# Altium schematic sheet DM2080_LEFT_OV9782.SchDoc: =project_title
size Tabloid; PageSetup: Record=PageOptions|CenterHorizontal=True|CenterVertical=True|PrintScale=0.71|XCorrection=1.00|YCorrection=1.00|PrintKind=0|BorderSize=5000000|LeftOffset=0|BottomOffset=0|Orientation=2|PaperLength=1000|PaperWidth=1000|Scale=100|PaperSource=7|PrintQuality=-4|MediaType=1|DitherType=10|PrintScaleMode=1|PaperKind=A4; CompanyName: Luxonis Holding; Organization: Luxonis Holding; Address1: 1925 Harmony Park Drive; Address2: Westminster, CO; Address3: 80234; Address4: United States; SheetNumber: 6; SheetTotal: 9
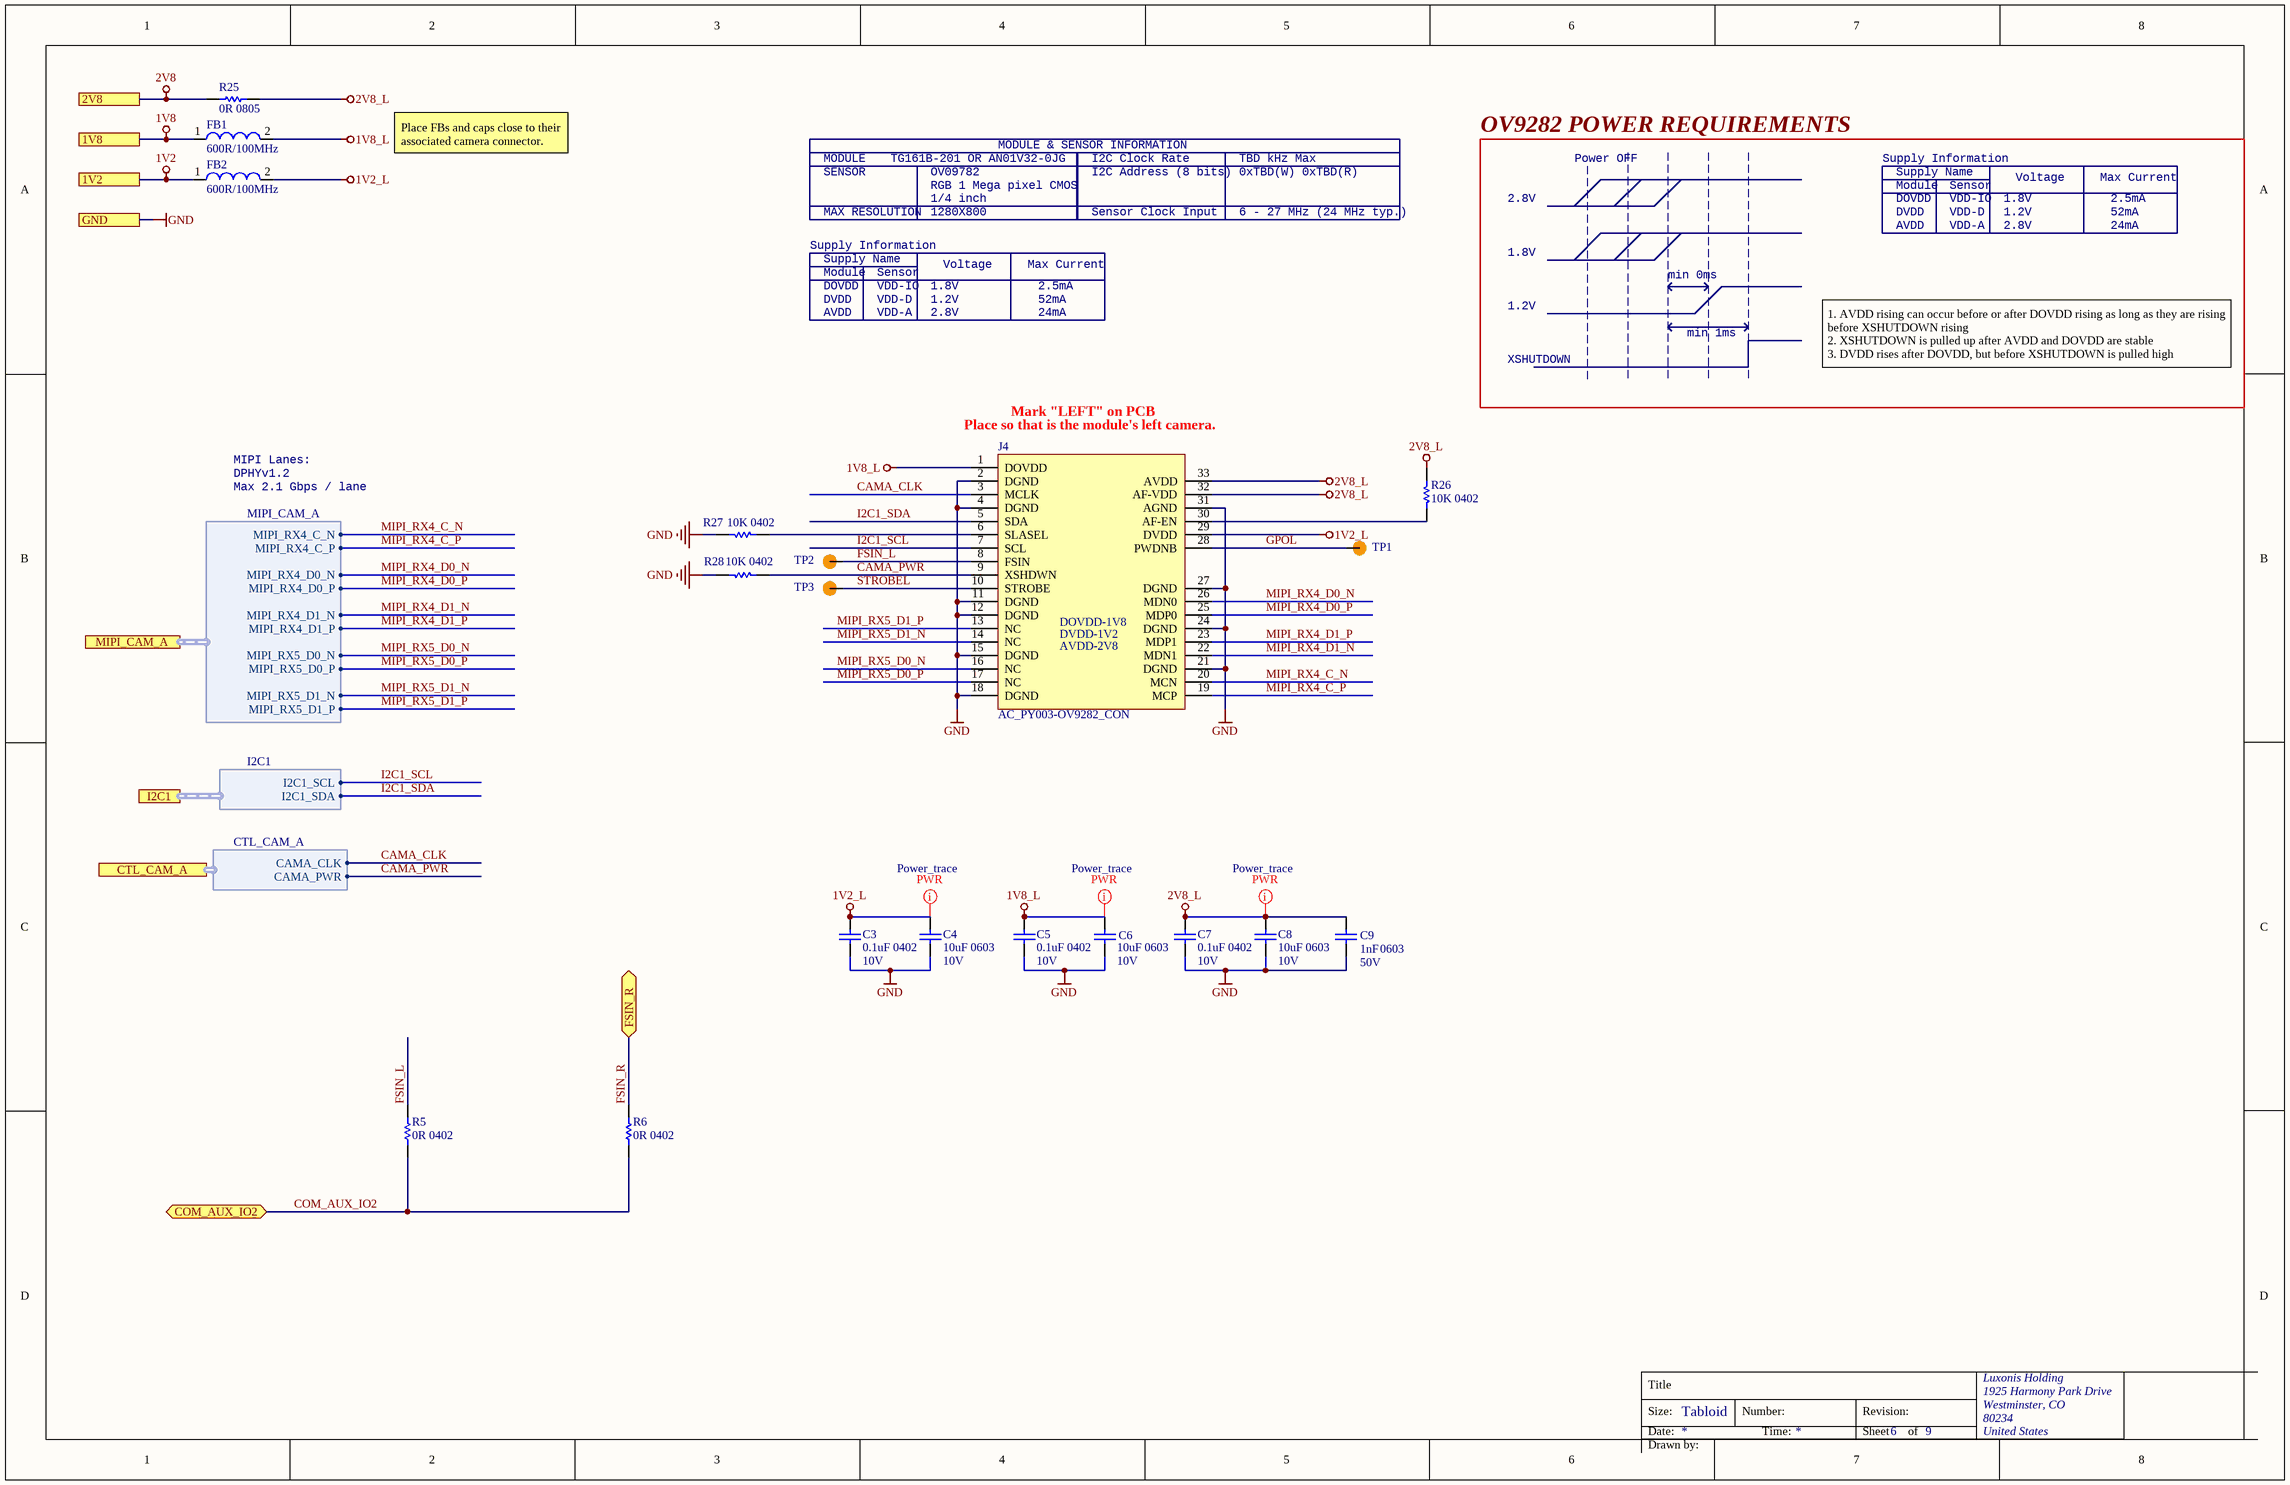
[diagram p0: DM2080_LEFT_OV9782.SchDoc]

## Parts
C3  0.1uF 0402  Voltage Rating: 10V  [CAPC0402(1005)70_L]
C4  10uF 0603  Voltage Rating: 10V  [CAPC0603(1608)100_L]
C5  0.1uF 0402  Voltage Rating: 10V  [CAPC0402(1005)70_L]
C6  10uF 0603  Voltage Rating: 10V  [CAPC0603(1608)100_L]
C7  0.1uF 0402  Voltage Rating: 10V  [CAPC0402(1005)70_L]
C8  10uF 0603  Voltage Rating: 10V  [CAPC0603(1608)100_L]
C9  Case/Package: 0603  Capacitance: 1nF  Voltage Rating: 50V  [CAPC0603(1608)100_L]  (hidden comment: 1nF 0603 C0G)
FB1  600R/100MHz  [2508056017Y2]
FB2  600R/100MHz  [2508056017Y2]
J4  AC_PY003-OV9282_CON  [AC-PY003-OV9282]
R5  0R 0402  [RESC0402(1005)_L]
R6  0R 0402  [RESC0402(1005)_L]
R25  0R 0805  [RESC0805(2012)_L]
R26  10K 0402  [RESC0402(1005)_L]
R27  10K 0402  [RESC0402(1005)_L]
R28  10K 0402  [RESC0402(1005)_L]
TP1  TP100_200_NS  [TP100_200_NS]  (value not drawn)  (no BOM)
TP2  TP100_200_NS  [TP100_200_NS]  (value not drawn)  (no BOM)
TP3  TP100_200_NS  [TP100_200_NS]  (value not drawn)  (no BOM)

## Ports
1V2, 1V8, 2V8, COM_AUX_IO2 (bidir), CTL_CAM_A (harness CTL_CAM_A), FSIN_R (bidir), GND, I2C1 (harness I2C1), MIPI_CAM_A (harness MIPI_CAM_A)

## Harnesses
MIPI_CAM_A: MIPI_RX4_C_P, MIPI_RX4_C_N, MIPI_RX4_D0_P, MIPI_RX4_D0_N, MIPI_RX4_D1_P, MIPI_RX4_D1_N, MIPI_RX5_D0_P, MIPI_RX5_D0_N, MIPI_RX5_D1_P, MIPI_RX5_D1_N
I2C1: I2C1_SDA, I2C1_SCL
CTL_CAM_A: CAMA_PWR, CAMA_CLK

## Nets
1V2: FB2.1 ; port 1V2
1V2_L: C3.2 C4.2 FB2.2 J4.29(DVDD)
1V8: FB1.1 ; port 1V8
1V8_L: C5.2 C6.2 FB1.2 J4.1(DOVDD)
2V8: R25.1 ; port 2V8
2V8_L: C7.2 C8.2 C9.2 J4.32(AF-VDD) J4.33(AVDD) R25.2 R26.1
GND: C3.1 C4.1 C5.1 C6.1 C7.1 C8.1 C9.1 J4.2(DGND) J4.4(DGND) J4.11(DGND) J4.12(DGND) J4.15(DGND) J4.18(DGND) J4.21(DGND) J4.24(DGND) J4.27(DGND) J4.31(AGND) R27.2 R28.2 ; port GND
CAMA_CLK: J4.3(MCLK) ; port CTL_CAM_A.CAMA_CLK
CAMA_PWR: J4.9(XSHDWN) R28.1 ; port CTL_CAM_A.CAMA_PWR
COM_AUX_IO2: R5.2 R6.2 ; port COM_AUX_IO2
FSIN_L: J4.8(FSIN) R5.1 TP2.1
FSIN_R: R6.1 ; port FSIN_R
GPOL: J4.28(PWDNB) TP1.1
I2C1_SCL: J4.7(SCL) ; port I2C1.I2C1_SCL
I2C1_SDA: J4.5(SDA) ; port I2C1.I2C1_SDA
MIPI_RX4_C_N: J4.20(MCN) ; port MIPI_CAM_A.MIPI_RX4_C_N
MIPI_RX4_C_P: J4.19(MCP) ; port MIPI_CAM_A.MIPI_RX4_C_P
MIPI_RX4_D0_N: J4.26(MDN0) ; port MIPI_CAM_A.MIPI_RX4_D0_N
MIPI_RX4_D0_P: J4.25(MDP0) ; port MIPI_CAM_A.MIPI_RX4_D0_P
MIPI_RX4_D1_N: J4.22(MDN1) ; port MIPI_CAM_A.MIPI_RX4_D1_N
MIPI_RX4_D1_P: J4.23(MDP1) ; port MIPI_CAM_A.MIPI_RX4_D1_P
MIPI_RX5_D0_N: J4.16(NC) ; port MIPI_CAM_A.MIPI_RX5_D0_N
MIPI_RX5_D0_P: J4.17(NC) ; port MIPI_CAM_A.MIPI_RX5_D0_P
MIPI_RX5_D1_N: J4.14(NC) ; port MIPI_CAM_A.MIPI_RX5_D1_N
MIPI_RX5_D1_P: J4.13(NC) ; port MIPI_CAM_A.MIPI_RX5_D1_P
STROBEL: J4.10(STROBE) TP3.1
NetJ4_6: J4.6(SLASEL) R27.1
NetJ4_30: J4.30(AF-EN) R26.2

## Layout directives
net class Power_trace: 1V2_L, 1V8_L, 2V8_L

## Notes on the sheet
- Place FBs and caps close to their associated camera connector.
- MODULE
- TG161B-201 OR AN01V32-0JG
- MODULE & SENSOR INFORMATION
- I2C Clock Rate
- TBD kHz Max
- OV9282 POWER REQUIREMENTS
- Power OFF
- Supply Information
- SENSOR
- MAX RESOLUTION
- RGB 1 Mega pixel CMOS
- 1280X800
- OV09782
- 1/4 inch
- I2C Address (8 bits)
- Sensor Clock Input
- 6 - 27 MHz (24 MHz typ.)
- 0xTBD(W) 0xTBD(R)
- 2.8V
- AVDD
- DOVDD
- DVDD
- Supply Name
- Module
- VDD-A
- VDD-IO
- VDD-D
- Sensor
- 1.8V
- 1.2V
- Voltage
- Max Current
- 24mA
- 2.5mA
- 52mA
- min 0ms
- XSHUTDOWN
- min 1ms
- 1. AVDD rising can occur before or after DOVDD rising as long as they are rising before XSHUTDOWN rising
  2. XSHUTDOWN is pulled up after AVDD and DOVDD are stable
  3. DVDD rises after DOVDD, but before XSHUTDOWN is pulled high
- (near J4) Place so that is the module's left camera.
- (near J4) Mark "LEFT" on PCB
- MIPI Lanes:
- Max 2.1 Gbps / lane
- DPHYv1.2
- Title
- Size:
- Date:
- Tabloid
- Number:
- Time:
- Revision:
- Sheet
- of
- Drawn by:
- (in symbol CMP-005-000036-1) DOVDD-1V8; DVDD-1V2; AVDD-2V8

## Library data of the parts
C3 C5 C7 = GRM155R71A104JA01D: CAP CER 0.1UF 10V X7R 0402 5%; Manufacturer 1: Murata; Capacitance: 100nF; Supplier 1: Digi-Key; Manufacturer Part Number 1: GRM155R71A104JA01D; Stock 1: 1346709; Pricing 1: 1=0.10000, 10=0.02500, 100=0.01130, 500=0.00806, 1000=0.00633, 2500=0.00575, 5000=0.00529 (USD); RoHS: Yes; Mount: Surface Mount; Case/Package: 0402; Case Code (Imperial): 0402; Case Code (Metric): 1005; Min Operating Temperature: -55°C; Max Operating Temperature: 125°C; Tolerance: 5%; Packaging: Tape and Reel; Voltage Rating (DC): 10V; Dielectric: X7R; Package Quantity: 10000; Termination: SMD/SMT; Length: 1mm; Height: 0.5mm; Width: 0.02inch; Thickness: 0.022inch; Depth: 0.5mm; Radiation Hardening: No; Lead Free: Lead Free; ComponentLink1URL: https://datasheet.ciiva.com/5411/product-5411135.pdf?src-supplier=Mouser; ComponentLink1Description: https://datasheet.ciiva.com/5411/product-5411135.pdf?src-supplier=Mouser; ComponentLink2URL: https://datasheet.ciiva.com/11618/c02e-11618821.pdf?src-supplier=Avnet; ComponentLink2Description: https://datasheet.ciiva.com/11618/c02e-11618821.pdf?src-supplier=Avnet; Supplier Part Number 1: 490-10777-1-ND
C4 C6 C8 = GRM188R61A106ME69D: CAP CER 10UF 10V X5R 0603 20%; Manufacturer 1: Murata; Material: Ceramic; Supplier 1: Digi-Key; Manufacturer Part Number 1: GRM188R61A106ME69D; Stock 1: 2873098; Pricing 1: 1=0.21000, 10=0.14100, 100=0.07130, 500=0.04876, 1000=0.04313 (USD); RoHS: Yes; Mount: Surface Mount; Case/Package: 0603; Weight: 0.000222oz; Case Code (Metric): 1608; Case Code (Imperial): 0603; Min Operating Temperature: -55°C; Max Operating Temperature: 85°C; Packaging: Tape and Reel; Tolerance: 20%; Capacitance: 10uF; Dielectric: X5R; Voltage Rating (DC): 10V; Package Quantity: 4000; Termination: SMD/SMT; Length: 1.6mm; Height: 0.8mm; Width: 0.8mm; Thickness: 0.035inch; Depth: 0.8mm; REACH SVHC: Unknown; Lead Free: Lead Free; ComponentLink1URL: http://www.mouser.com/ds/2/281/c02e-2905.pdf?src-supplier=Mouser; ComponentLink1Description: http://www.mouser.com/ds/2/281/c02e-2905.pdf?src-supplier=Mouser; ComponentLink2URL: http://components.arrow.com/part/dataview/0323_06119472?src-supplier=Arrow+Europe; ComponentLink2Description: http://components.arrow.com/part/dataview/0323_06119472?src-supplier=Arrow+Europe; ComponentLink3URL: http://www.farnell.com/datasheets/2048014.pdf?src-supplier=Farnell; ComponentLink3Description: http://www.farnell.com/datasheets/2048014.pdf?src-supplier=Farnell; ComponentLink4URL: http://www.farnell.com/datasheets/1872210.pdf?src-supplier=Farnell; ComponentLink4Description: http://www.farnell.com/datasheets/1872210.pdf?src-supplier=Farnell; ComponentLink5URL: http://search.murata.co.jp/Ceramy/image/img/A01X/G101/ENG/GRM188R61A106ME69-01.pdf?src-supplier=Digi-Key; ComponentLink5Description: http://search.murata.co.jp/Ceramy/image/img/A01X/G101/ENG/GRM188R61A106ME69-01.pdf?src-supplier=Digi-Key; ComponentLink6URL: http://www.farnell.com/datasheets/1872210.pdf?src-supplier=Newark; ComponentLink6Description: http://www.farnell.com/datasheets/1872210.pdf?src-supplier=Newark; ComponentLink7URL: http://www.farnell.com/datasheets/2048014.pdf?src-supplier=Element14; ComponentLink7Description: http://www.farnell.com/datasheets/2048014.pdf?src-supplier=Element14; ComponentLink8URL: http://www.farnell.com/datasheets/2048014.pdf?src-supplier=Newark; ComponentLink8Description: http://www.farnell.com/datasheets/2048014.pdf?src-supplier=Newark; Supplier Part Number 1: 490-10475-1-ND
C9 = GRM1885C1H102FA01D: CAP CER 1000PF 50V C0G/NP0 0603; Manufacturer: Murata; Material: Ceramic; Tolerance: 1%; Temperature Coefficient: 30ppm/°C; Manufacturer Part Number: GRM1885C1H102FA01D; RoHS: Yes; Mount: Surface Mount; Number of Pins: 2; Case Code (Metric): 1608; Case Code (Imperial): 0603; Min Operating Temperature: -55°C; Max Operating Temperature: 125°C; Packaging: Tape and Reel; Package Quantity: 4000; Termination: SMD/SMT; Voltage Rating (DC): 50V; Voltage: 50V; Length: 1.6mm; Height: 0.8mm; Width: 0.031inch; Thickness: 0.035inch; Depth: 0.8mm; Radiation Hardening: No; REACH SVHC: No SVHC; Lead Free: Lead Free; ComponentLink1URL: https://datasheet.ciiva.com/6072/1747444-6072454.pdf?src-supplier=Farnell; ComponentLink1Description: https://datasheet.ciiva.com/6072/1747444-6072454.pdf?src-supplier=Farnell; ComponentLink2URL: https://datasheet.ciiva.com/7828/1747444-7828892.pdf?src-supplier=Element14; ComponentLink2Description: https://datasheet.ciiva.com/7828/1747444-7828892.pdf?src-supplier=Element14; ComponentLink3URL: https://datasheet.ciiva.com/11621/c02e-11621692.pdf?src-supplier=Avnet; ComponentLink3Description: https://datasheet.ciiva.com/11621/c02e-11621692.pdf?src-supplier=Avnet; ComponentLink4URL: https://datasheet.ciiva.com/16624/c02e-16624140.pdf?src-supplier=Avnet+Europe; ComponentLink4Description: https://datasheet.ciiva.com/16624/c02e-16624140.pdf?src-supplier=Avnet+Europe; ComponentLink5URL: https://datasheet.ciiva.com/22698/1747444-22698428.pdf?src-supplier=Element14; ComponentLink5Description: https://datasheet.ciiva.com/22698/1747444-22698428.pdf?src-supplier=Element14; ComponentLink6URL: https://datasheet.ciiva.com/5416/c02e-5416637.pdf?src-supplier=Mouser; ComponentLink6Description: https://datasheet.ciiva.com/5416/c02e-5416637.pdf?src-supplier=Mouser; ComponentLink7URL: https://datasheet.ciiva.com/6270/partnumbering-e-01-6270573.pdf?src-supplier=Digi-Key; ComponentLink7Description: https://datasheet.ciiva.com/6270/partnumbering-e-01-6270573.pdf?src-supplier=Digi-Key; ComponentLink8URL: https://datasheet.ciiva.com/6270/partnumbering-e-01-6270574.pdf?src-supplier=Digi-Key; ComponentLink8Description: https://datasheet.ciiva.com/6270/partnumbering-e-01-6270574.pdf?src-supplier=Digi-Key; ComponentLink9URL: https://datasheet.ciiva.com/6270/partnumbering-e-01-6270575.pdf?src-supplier=Digi-Key; ComponentLink9Description: https://datasheet.ciiva.com/6270/partnumbering-e-01-6270575.pdf?src-supplier=Digi-Key; ComponentLink10URL: https://datasheet.ciiva.com/16426/l0005e-16426367.pdf?src-supplier=Future+Electronics; ComponentLink10Description: https://datasheet.ciiva.com/16426/l0005e-16426367.pdf?src-supplier=Future+Electronics; Supplier 1: Digi-Key; Manufacturer 1: Murata; Manufacturer Part Number 1: GRM1885C1H102FA01D; Stock 1: 343900; Pricing 1: 1=0.19000, 10=0.13300, 100=0.06260, 500=0.04386, 1000=0.03631 (USD); Dielectric: C0G; Supplier Part Number 1: 490-6376-1-ND
FB1 FB2 = 2508056017Y2: FERRITE BEAD, 0.1OHM, 2A, 0805, 600R/100MHz; Manufacturer 1: Fair-Rite; Impedance: 600R; Tolerance: 25%; Resistance: 350mR; DC Resistance (DCR): 100mR; Test Frequency: 100MHz; Supplier 1: Digi-Key; Manufacturer Part Number 1: 2508056017Y2; Stock 1: 100491; Pricing 1: 1=0.10000, 10=0.07900, 25=0.07120, 50=0.05240, 100=0.04520, 250=0.03568, 500=0.03014, 1000=0.02538 (USD); RoHS: Yes; Case/Package: 0805; Number of Pins: 2; Case Code (Metric): 2012; Case Code (Imperial): 0805; Min Operating Temperature: -55°C; Max Operating Temperature: 125°C; Package Quantity: 4000; Packaging: Tape and Reel; Max DC Current: 2A; Termination: SMD/SMT; Military Standard: Not; DC Current: 2A; Current Rating: 2A; Frequency: 100MHz; Length: 2mm; Height: 0.9mm; Width: 1.25mm; Depth: 1.25mm; Radiation Hardening: No; REACH SVHC: No SVHC; ComponentLink1URL: https://datasheet.ciiva.com/3854/3802508056017y2-3854245.pdf?src-supplier=Arrow; ComponentLink1Description: https://datasheet.ciiva.com/3854/3802508056017y2-3854245.pdf?src-supplier=Arrow; ComponentLink2URL: https://datasheet.ciiva.com/22735/652149-22735047.pdf?src-supplier=Element14; ComponentLink2Description: https://datasheet.ciiva.com/22735/652149-22735047.pdf?src-supplier=Element14; ComponentLink3URL: https://datasheet.ciiva.com/1127/26143-1127514.pdf?src-supplier=Farnell; ComponentLink3Description: https://datasheet.ciiva.com/1127/26143-1127514.pdf?src-supplier=Farnell; ComponentLink4URL: https://datasheet.ciiva.com/18090/getdatasheetpartid-212640-18090187.pdf?src-supplier=Verical; ComponentLink4Description: https://datasheet.ciiva.com/18090/getdatasheetpartid-212640-18090187.pdf?src-supplier=Verical; ComponentLink5URL: https://datasheet.ciiva.com/7620/26143-7620140.pdf?src-supplier=Element14; ComponentLink5Description: https://datasheet.ciiva.com/7620/26143-7620140.pdf?src-supplier=Element14; Supplier Part Number 1: 1934-1487-1-ND
J4 = CMP-005-000036-1: FFC/FPC Connector, 33 Contact(s), 1 Row(s), Female, Right Angle, Surface Mount Terminal; Manufacturer 1: Hirose; Manufacturer Part Number 1: FH26W-33S-0.3SHW(60); ComponentLink1Description: https://datasheet.ciiva.com:443/pdfs/VipMasterIC/IC/HIRO/HIRO-S-A0007913874/HIRO-S-A0008593114-1.pdf?src-supplier=IHS+Markit; ComponentLink3Description: https://www.hirose.com/product/download/?distributor=digikey&amp;type=2d&amp;lang=en&amp;num=FH26W-13S-0.3SHW(60)&src-supplier=Digi-Key; ComponentLink1URL: https://datasheet.ciiva.com:443/pdfs/VipMasterIC/IC/HIRO/HIRO-S-A0007913874/HIRO-S-A0008593114-1.pdf?src-supplier=IHS+Markit; Source: LuxonisMaster.SchLib; ComponentLink2Description: https://www.hirose.com/product/en/download_file/key_name/FH26/category/Catalog/doc_file_id/49355/?file_category_id=4&item_id=298&is_series=1&src-supplier=Digi-Key; Pricing 1: 1=1,78000, 10=1,61700, 25=1,51800, 50=1,45200, 100=1,38600, 250=1,25400, 500=1,15500, 1000=0,99000, 2500=0,92400 (USD); Category: FFC / FPC; Design Item ID: AC_PY003-OV9282_CON; ComponentLink2URL: https://www.hirose.com/product/en/download_file/key_name/FH26/category/Catalog/doc_file_id/49355/?file_category_id=4&item_id=298&is_series=1&src-supplier=Digi-Key; RoHS: Yes; Stock 1: 627; ComponentLink3URL: https://www.hirose.com/product/download/?distributor=digikey&amp;type=2d&amp;lang=en&amp;num=FH26W-13S-0.3SHW(60)&src-supplier=Digi-Key
R5 R6 = CRCW04020000Z0ED: RES SMD 0 OHM JUMPER 1/16W 0402; Manufacturer 1: Vishay; Resistance: 0mR; Power Rating: 63mW; Voltage Rating: 50V; Temperature Coefficient: 100ppm/°C; Tolerance: 5%; Manufacturer Part Number 1: CRCW04020000Z0ED; Supplier 1: Digi-Key; Stock 1: 855968; Pricing 1: 1=0.10000, 10=0.03400, 25=0.02440, 50=0.01860, 100=0.01380, 250=0.01048, 500=0.00840, 1000=0.00618, 5000=0.00443 (USD); RoHS: Yes; Mount: Surface Mount; Case/Package: 0402; Weight: 2.3E-05oz; Case Code (Imperial): 0402; Case Code (Metric): 1005; Contact Plating: Tin; Min Operating Temperature: -55°C; Max Operating Temperature: 155°C; Packaging: Tape and Reel; Composition: Thick Film; Voltage Rating (DC): 50V; Package Quantity: 1; Termination: SMD/SMT; Number of Terminations: 2; Military Standard: Not; Max Power Dissipation: 63mW; Features: Automotive AEC-Q200; Length: 1mm; Height: 0.35mm; Width: 0.5mm; Depth: 0.5mm; Radiation Hardening: No; REACH SVHC: Unknown; Lead Free: Lead Free; ComponentLink1URL: https://datasheet.ciiva.com/3255/dcrcwe3-3255944.pdf?src-supplier=Avnet; ComponentLink1Description: https://datasheet.ciiva.com/3255/dcrcwe3-3255944.pdf?src-supplier=Avnet; ComponentLink2URL: https://datasheet.ciiva.com/3255/dcrcwe3-3255945.pdf?src-supplier=Avnet; ComponentLink2Description: https://datasheet.ciiva.com/3255/dcrcwe3-3255945.pdf?src-supplier=Avnet; ComponentLink3URL: https://datasheet.ciiva.com/16881/dcrcwe3-16881413.pdf?src-supplier=Avnet+Europe; ComponentLink3Description: https://datasheet.ciiva.com/16881/dcrcwe3-16881413.pdf?src-supplier=Avnet+Europe; ComponentLink4URL: https://datasheet.ciiva.com/2461/dcrcwe3-2461962.pdf?src-supplier=Digi-Key; ComponentLink4Description: https://datasheet.ciiva.com/2461/dcrcwe3-2461962.pdf?src-supplier=Digi-Key; ComponentLink5URL: https://datasheet.ciiva.com/7841/1720486-7841802.pdf?src-supplier=Element14; ComponentLink5Description: https://datasheet.ciiva.com/7841/1720486-7841802.pdf?src-supplier=Element14; ComponentLink6URL: https://datasheet.ciiva.com/2461/dcrcwe3-2461963.pdf?src-supplier=Digi-Key; ComponentLink6Description: https://datasheet.ciiva.com/2461/dcrcwe3-2461963.pdf?src-supplier=Digi-Key; ComponentLink7URL: https://datasheet.ciiva.com/2461/dcrcwe3-2461964.pdf?src-supplier=Digi-Key; ComponentLink7Description: https://datasheet.ciiva.com/2461/dcrcwe3-2461964.pdf?src-supplier=Digi-Key; ComponentLink8URL: https://datasheet.ciiva.com/7841/1697337-7841468.pdf?src-supplier=Element14; ComponentLink8Description: https://datasheet.ciiva.com/7841/1697337-7841468.pdf?src-supplier=Element14; ComponentLink9URL: https://datasheet.ciiva.com/16761/70200976-16761309.pdf?src-supplier=Allied+Electronics; ComponentLink9Description: https://datasheet.ciiva.com/16761/70200976-16761309.pdf?src-supplier=Allied+Electronics; ComponentLink10URL: https://datasheet.ciiva.com/26311/fld-crcw-e3-data-en-26311550.pdf?src-supplier=Distrelec; ComponentLink10Description: https://datasheet.ciiva.com/26311/fld-crcw-e3-data-en-26311550.pdf?src-supplier=Distrelec; Supplier Part Number 1: 541-0.0JCT-ND
R25 = CRCW08050000Z0EA: RES SMD 0.0R OHM 1% 1/8W 0805; Manufacturer 1: Vishay; Rated Temperature: 70°C; Rated Power Dissipation (P): 125mW; Package Height: 0.45mm; Package Length: 2mm; Package Width: 1.25mm; Reference Standard: AEC-Q200; Supplier 1: RSComponents; Manufacturer Part Number 1: CRCW08050000Z0EA; RoHS: Yes; Category: Chip SMD Resistors; Stock 1: 850; Pricing 1: 50=0,02700, 250=0,02400, 500=0,02000, 750=0,01500, 1000=0,01300, 50=0,01900, 250=0,01700, 500=0,01400, 750=0,01100, 1000=0,00900 (USD); Mount: Surface Mount; Number of Pins: 2; Terminal Finish: Nickel; Package Shape: Rectangular; Min Operating Temperature: -55°C; Max Operating Temperature: 155°C; Resistor Type: FIXED RESISTOR; Packaging: Tape and Reel; JESD-609 Code: e3; Termination: Wraparound; Construction: Chip; Package Style: SMTMeter; Technology: METAL GLAZE/THICK FILM; REACH SVHC: Yes; RoHS Compliant: Yes; ComponentLink1URL: https://datasheet.ciiva.com:443/pdfs/VipMasterIC/IC/VISH/VISH-S-A0007266705/VISH-S-A0007266705-1.pdf?src-supplier=IHS+Markit; ComponentLink1Description: https://datasheet.ciiva.com:443/pdfs/VipMasterIC/IC/VISH/VISH-S-A0007266705/VISH-S-A0007266705-1.pdf?src-supplier=IHS+Markit; ComponentLink2URL: https://datasheet.ciiva.com/11811/0900766b80d98b26-11811304.pdf?src-supplier=RSComponents; ComponentLink2Description: https://datasheet.ciiva.com/11811/0900766b80d98b26-11811304.pdf?src-supplier=RSComponents; ComponentLink3URL: https://datasheet.ciiva.com/16883/dcrcwe3-16883622.pdf?src-supplier=Avnet+Europe; ComponentLink3Description: https://datasheet.ciiva.com/16883/dcrcwe3-16883622.pdf?src-supplier=Avnet+Europe; ComponentLink4URL: https://datasheet.ciiva.com/26314/fld-crcw-e3-data-en-26314630.pdf?src-supplier=Distrelec; ComponentLink4Description: https://datasheet.ciiva.com/26314/fld-crcw-e3-data-en-26314630.pdf?src-supplier=Distrelec; ComponentLink5URL: https://datasheet.ciiva.com/5543/dcrcwe3-109170-5543096.pdf?src-supplier=Mouser; ComponentLink5Description: https://datasheet.ciiva.com/5543/dcrcwe3-109170-5543096.pdf?src-supplier=Mouser; ComponentLink6URL: https://datasheet.ciiva.com/16389/dcrcwe3-16389338.pdf?src-supplier=Future+Electronics; ComponentLink6Description: https://datasheet.ciiva.com/16389/dcrcwe3-16389338.pdf?src-supplier=Future+Electronics; ComponentLink7URL: https://datasheet.ciiva.com/16719/70201119-16719706.pdf?src-supplier=Allied+Electronics; ComponentLink7Description: https://datasheet.ciiva.com/16719/70201119-16719706.pdf?src-supplier=Allied+Electronics; ComponentLink8URL: https://datasheet.ciiva.com/2463/dcrcwe3-2463037.pdf?src-supplier=Digi-Key; ComponentLink8Description: https://datasheet.ciiva.com/2463/dcrcwe3-2463037.pdf?src-supplier=Digi-Key; ComponentLink9URL: https://datasheet.ciiva.com/7841/1697337-7841629.pdf?src-supplier=Element14; ComponentLink9Description: https://datasheet.ciiva.com/7841/1697337-7841629.pdf?src-supplier=Element14; ComponentLink10URL: https://datasheet.ciiva.com/2463/dcrcwe3-2463038.pdf?src-supplier=Digi-Key; ComponentLink10Description: https://datasheet.ciiva.com/2463/dcrcwe3-2463038.pdf?src-supplier=Digi-Key; ComponentLink11URL: https://datasheet.ciiva.com/2463/dcrcwe3-2463039.pdf?src-supplier=Digi-Key; ComponentLink11Description: https://datasheet.ciiva.com/2463/dcrcwe3-2463039.pdf?src-supplier=Digi-Key; ComponentLink12URL: https://datasheet.ciiva.com/7841/1720486-7841839.pdf?src-supplier=Element14; ComponentLink12Description: https://datasheet.ciiva.com/7841/1720486-7841839.pdf?src-supplier=Element14; Supplier Part Number 1: 6790800; Resistance: 0R; Size Code: 0805
R26-R28 = RC0402FR-1310KL: RES SMD 10K OHM 1% 0402 1/16W Chip Resistor, 0402 [1005 Metric], 10 kohm, RC Series, 50 V, Thick Film, 62.5 mW; Manufacturer 1: Yageo; Resistance: 10kR; Temperature Coefficient: 100ppm/°C; Power Rating: 62.5mW; Voltage Rating: 50V; ComponentLink1URL: https://datasheet.ciiva.com/16940/pyu-rc0402-51-rohs-l-6-16940293.pdf?src-supplier=Avnet+Europe; ComponentLink1Description: https://datasheet.ciiva.com/16940/pyu-rc0402-51-rohs-l-6-16940293.pdf?src-supplier=Avnet+Europe; ComponentLink2URL: https://datasheet.ciiva.com/28386/pyu-rc0402-51-rohs-l-6-28386855.pdf?src-supplier=Avnet+Europe; ComponentLink2Description: https://datasheet.ciiva.com/28386/pyu-rc0402-51-rohs-l-6-28386855.pdf?src-supplier=Avnet+Europe; ComponentLink3URL: https://datasheet.ciiva.com/16740/pyu-rc0402-51-rohs-l-6-r-16740602.pdf?src-supplier=Future+Electronics; ComponentLink3Description: https://datasheet.ciiva.com/16740/pyu-rc0402-51-rohs-l-6-r-16740602.pdf?src-supplier=Future+Electronics; ComponentLink4URL: https://datasheet.ciiva.com/8891/pyu-rc0402-51-rohs-l-6-8891339.pdf?src-supplier=Avnet; ComponentLink4Description: https://datasheet.ciiva.com/8891/pyu-rc0402-51-rohs-l-6-8891339.pdf?src-supplier=Avnet; ComponentLink5URL: https://datasheet.ciiva.com/5557/pyu-rc0402-51-rohs-l-6-r-5557997.pdf?src-supplier=Mouser; ComponentLink5Description: https://datasheet.ciiva.com/5557/pyu-rc0402-51-rohs-l-6-r-5557997.pdf?src-supplier=Mouser; ComponentLink6URL: https://datasheet.ciiva.com/7983/1018594-7983533.pdf?src-supplier=Element14; ComponentLink6Description: https://datasheet.ciiva.com/7983/1018594-7983533.pdf?src-supplier=Element14; Supplier 1: Newark; Manufacturer Part Number 1: RC0402FR-1310KL; Stock 1: 62239; Pricing 1: 1=0.10000, 25=0.01200, 100=0.00400, 250=0.00400, 500=0.00300, 1000=0.00300 (USD); RoHS: Yes; Case/Package: 0402; Number of Pins: 2; Contact Plating: Tin,Matte,Lead; Case Code (Imperial): 0402; Case Code (Metric): 1005; Min Operating Temperature: -55°C; Max Operating Temperature: 155°C; Tolerance: 1%; Composition: Thick Film; Packaging: Tape and Reel; Termination: SMD/SMT; Military Standard: Not; Voltage Rating (DC): 50V; Working Voltage: 50V; Number of Terminations: 2; Length: 1mm; Depth: 0.5mm; Radiation Hardening: No; REACH SVHC: No SVHC; Lead Free: Lead Free; Supplier Part Number 1: 67R9960; Supplier 2: Future Electronics; Supplier 3: Mouser; Supplier 4: Element14; Supplier Part Number 2: RC0402FR-1310KL-CUTT; Supplier Part Number 3: 603-RC0402FR-1310KL; Supplier Part Number 4: 1799235
TP1-TP3 = TEST_POINT